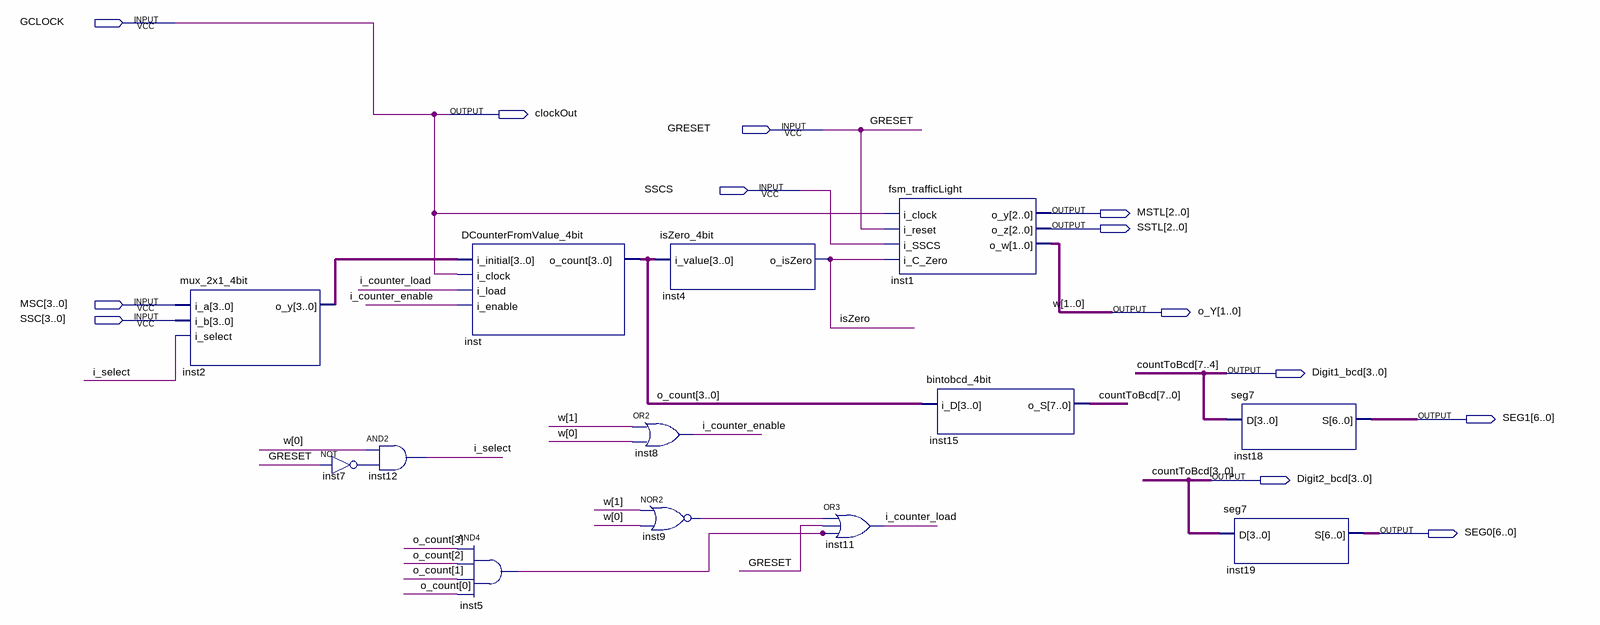
[diagram p0: schematic sheet]
// Quartus schematic topLevel_trafficLight.bdf as structural Verilog: 13 symbols, 13 pins
module topLevel_trafficLight (
  input  GCLOCK,
  input  GRESET,
  input  SSCS,
  input  [3:0] MSC,
  input  [3:0] SSC,
  output clockOut,
  output [2:0] MSTL,
  output [2:0] SSTL,
  output [1:0] o_Y,
  output [3:0] Digit1_bcd,
  output [6:0] SEG1,
  output [3:0] Digit2_bcd,
  output [6:0] SEG0
);

  wire i_counter_enable, i_counter_load, i_select, inst5_out, inst7_out, inst9_out, isZero;
  wire [3:0] inst2_o_y, o_count;

  mux_2x1_4bit inst2 (.i_a(MSC), .i_b(SSC), .i_select(i_select), .o_y(inst2_o_y));
  and inst12 (i_select, o_Y[0], inst7_out);
  not inst7 (inst7_out, GRESET);
  DCounterFromValue_4bit inst (
    .i_initial(inst2_o_y), .i_clock(GCLOCK), .i_load(i_counter_load), .i_enable(i_counter_enable),
    .o_count(o_count));
  and inst5 (inst5_out, o_count[3], o_count[2], o_count[1], o_count[0]);
  isZero_4bit inst4 (.i_value(o_count), .o_isZero(isZero));
  or inst8 (i_counter_enable, o_Y[1], o_Y[0]);
  nor inst9 (inst9_out, o_Y[1], o_Y[0]);
  or inst11 (i_counter_load, inst9_out, GRESET, inst5_out);
  fsm_trafficLight inst1 (
    .i_clock(GCLOCK), .i_reset(GRESET), .i_SSCS(SSCS), .i_C_Zero(isZero), .o_y(MSTL), .o_z(SSTL), .o_w(o_Y));
  bintobcd_4bit inst15 (.i_D(o_count), .o_S({Digit1_bcd, Digit2_bcd}));
  seg7 inst19 (.D(Digit2_bcd), .S(SEG0));
  seg7 inst18 (.D(Digit1_bcd), .S(SEG1));

  assign clockOut = GCLOCK;

  // Other names for the same wires on the sheet: countToBcd[7:0] = {Digit1_bcd, Digit2_bcd}; w[1:0] = o_Y
endmodule
